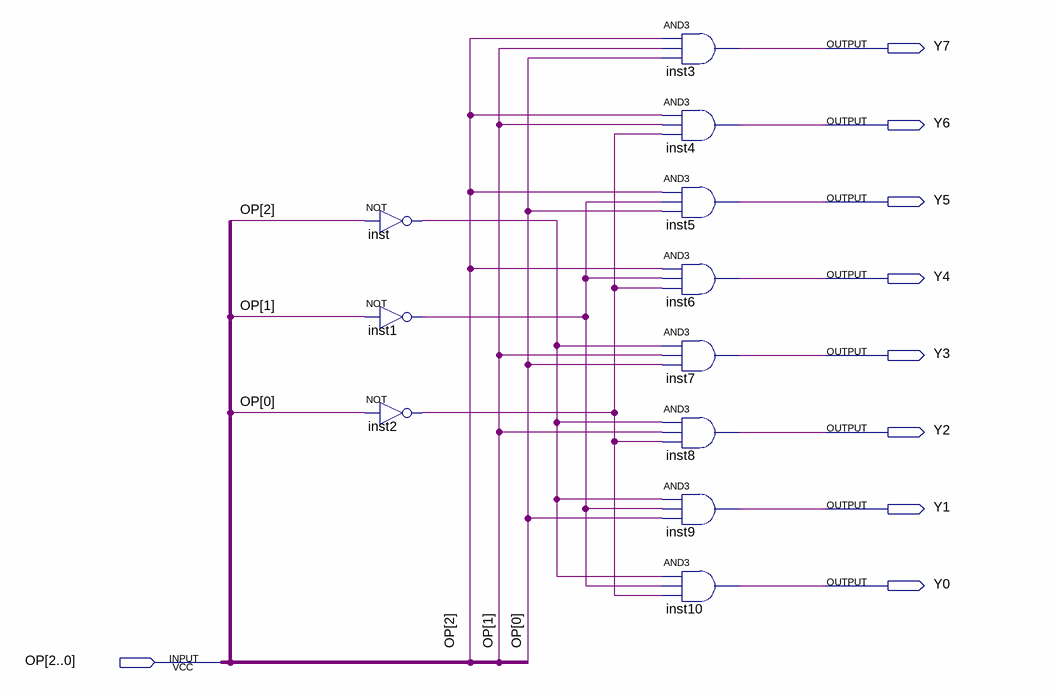
[diagram p0: schematic sheet]
// Quartus schematic DecodificadorOPCODE.bdf as structural Verilog: 11 symbols, 9 pins
module DecodificadorOPCODE (
  input  [2:0] OP,
  output Y7,
  output Y6,
  output Y5,
  output Y4,
  output Y3,
  output Y2,
  output Y1,
  output Y0
);

  wire inst1_out, inst2_out, inst_out;

  not inst (inst_out, OP[2]);
  not inst1 (inst1_out, OP[1]);
  not inst2 (inst2_out, OP[0]);
  and inst3 (Y7, OP[2], OP[1], OP[0]);
  and inst4 (Y6, OP[2], OP[1], inst2_out);
  and inst5 (Y5, OP[2], inst1_out, OP[0]);
  and inst6 (Y4, OP[2], inst1_out, inst2_out);
  and inst7 (Y3, inst_out, OP[1], OP[0]);
  and inst8 (Y2, inst_out, OP[1], inst2_out);
  and inst9 (Y1, inst_out, inst1_out, OP[0]);
  and inst10 (Y0, inst_out, inst1_out, inst2_out);
endmodule
